# EAGLE design Controller2019_sensorless (EAGLE 9.1.1)
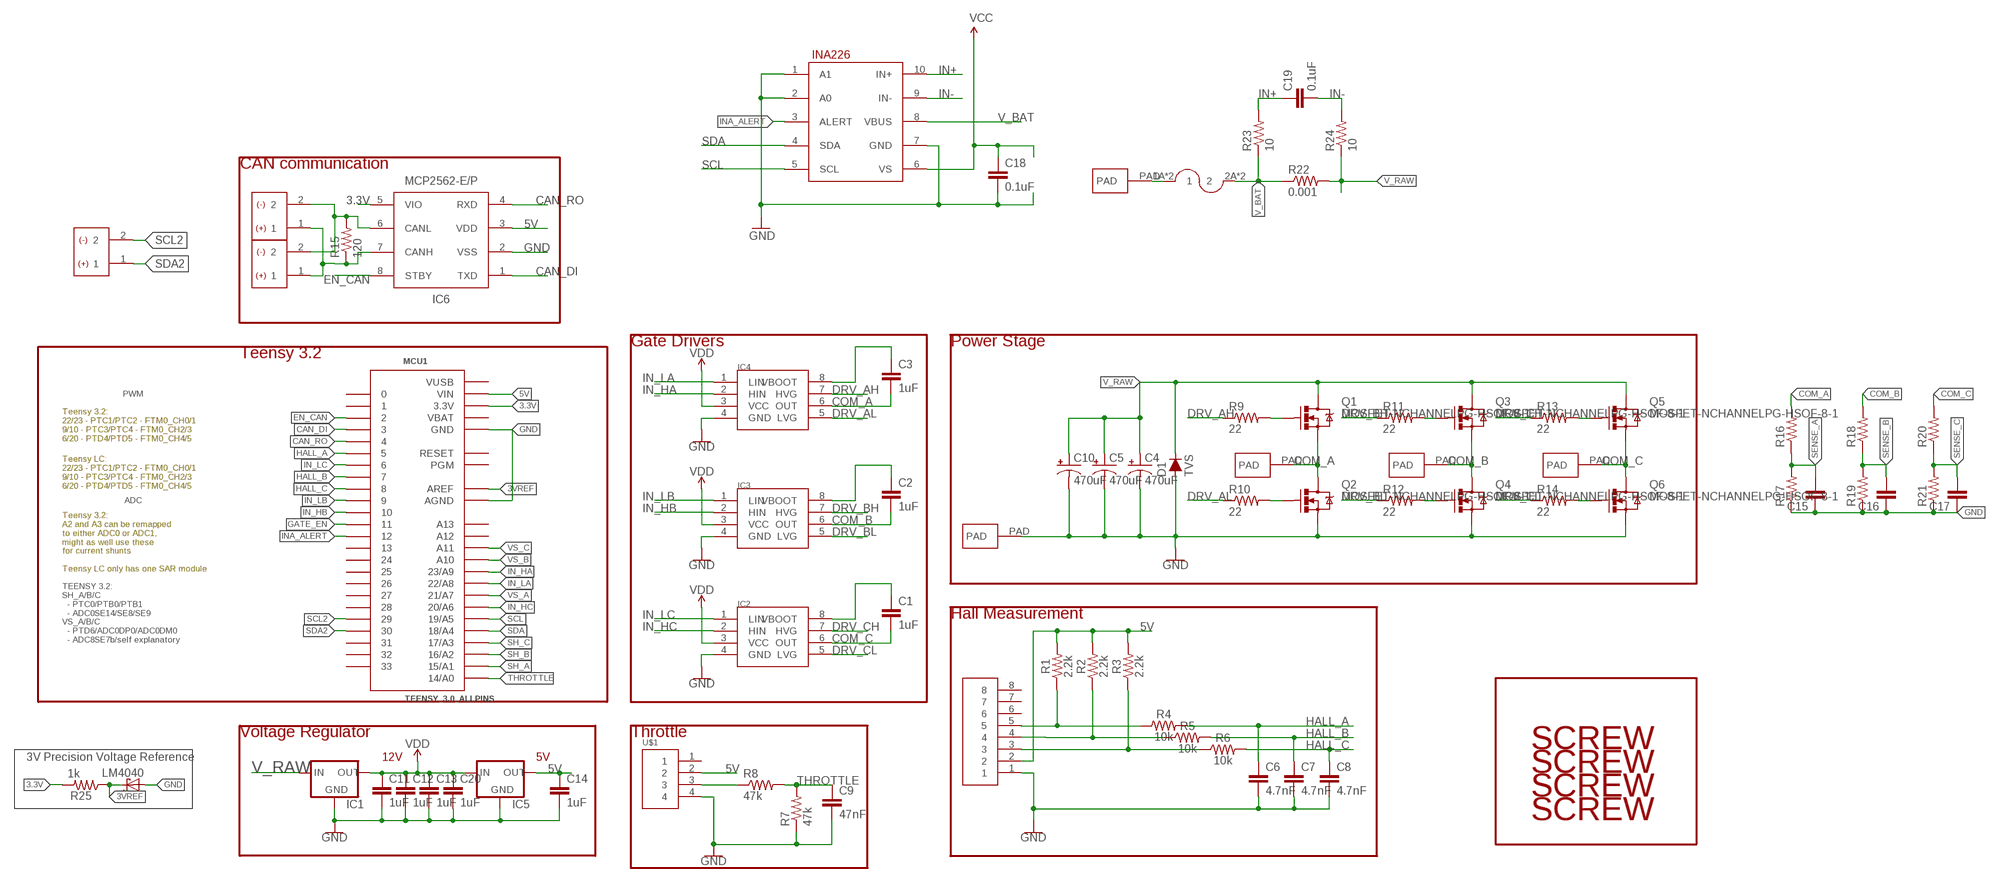
[diagram p0: schematic, sheet 1, part 1 of 2]
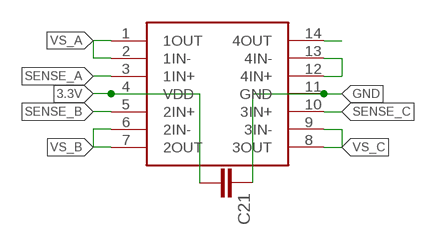
[diagram p1: schematic, sheet 1, part 2 of 2]

## Parts
C1  1uF  CAPKIT  [CAP-PTH-SMALL-KIT]
C2  1uF  CAPKIT  [CAP-PTH-SMALL-KIT]
C3  1uF  CAPKIT  [CAP-PTH-SMALL-KIT]
C4  470uF  1000UF-RADIAL-5MM-25V-20%  [CPOL-RADIAL-5MM-10MM]
C5  470uF  1000UF-RADIAL-5MM-25V-20%  [CPOL-RADIAL-5MM-10MM]
C6  4.7nF  CAP0603-CAP  [0603-CAP]
C7  4.7nF  CAP0603-CAP  [0603-CAP]
C8  4.7nF  CAP0603-CAP  [0603-CAP]
C9  47nF  CAP0603-CAP  [0603-CAP]
C10  470uF  1000UF-RADIAL-5MM-25V-20%  [CPOL-RADIAL-5MM-10MM]
C11  1uF  CAPKIT  [CAP-PTH-SMALL-KIT]
C12  1uF  CAPKIT  [CAP-PTH-SMALL-KIT]
C13  1uF  CAPKIT  [CAP-PTH-SMALL-KIT]
C14  1uF  CAPKIT  [CAP-PTH-SMALL-KIT]
C15  CAP0603-CAP  [0603-CAP]
C16  CAP0603-CAP  [0603-CAP]
C17  CAP0603-CAP  [0603-CAP]
C18  0.1uF  CAP0603-CAP  [0603-CAP]
C19  0.1uF  CAP0603-CAP  [0603-CAP]
C20  1uF  CAPKIT  [CAP-PTH-SMALL-KIT]
C21  CAP0603-CAP  [0603-CAP]
CAN1  HEADER2  [2PINVALULOK]
CAN2  HEADER2  [2PINVALULOK]
D1  TVS  DIODE-PTH  [DIODE-1N4001]
I2C  HEADER2  [2PINVALULOK]
IC1  V_REG_78XX  [V78W_BACKWARDS]
IC2  L6387EDIP8  [DIP762W53P254L1092H508Q8B]
IC3  L6387EDIP8  [DIP762W53P254L1092H508Q8B]
IC4  L6387EDIP8  [DIP762W53P254L1092H508Q8B]
IC5  V_REG_78XXV78W  [V78W]
IC6  MCP2562-E/P  [PDIP8_300MC]
IC7  INA226  [PSOP-10]
J3  FUSE  [AUTO_FUSE]
MCU1  TEENSY_3.0_ALLPINS  [TEENSY_3.0_ALLPINS]
Q1  MOSFET-NCHANNELPG-HSOF-8-1  [PG-HSOF-8-1]
Q2  MOSFET-NCHANNELPG-HSOF-8-1  [PG-HSOF-8-1]
Q3  MOSFET-NCHANNELPG-HSOF-8-1  [PG-HSOF-8-1]
Q4  MOSFET-NCHANNELPG-HSOF-8-1  [PG-HSOF-8-1]
Q5  MOSFET-NCHANNELPG-HSOF-8-1  [PG-HSOF-8-1]
Q6  MOSFET-NCHANNELPG-HSOF-8-1  [PG-HSOF-8-1]
R1  2.2k  RESISTOR0603  [0603]
R2  2.2k  RESISTOR0603  [0603]
R3  2.2k  RESISTOR0603  [0603]
R4  10k  RESISTOR0603  [0603]
R5  10k  RESISTOR0603  [0603]
R6  10k  RESISTOR0603  [0603]
R7  47k  RESISTOR0603-RES  [0603-RES]
R8  47k  RESISTOR0603-RES  [0603-RES]
R9  22  RESISTOR0603-RES  [0603-RES]
R10  22  RESISTOR0603-RES  [0603-RES]
R11  22  RESISTOR0603-RES  [0603-RES]
R12  22  RESISTOR0603-RES  [0603-RES]
R13  22  RESISTOR0603-RES  [0603-RES]
R14  22  RESISTOR0603-RES  [0603-RES]
R15  120  RESISTOR0603-RES  [0603-RES]
R16  RESISTOR0603-RES  [0603-RES]
R17  RESISTOR0603-RES  [0603-RES]
R18  RESISTOR0603-RES  [0603-RES]
R19  RESISTOR0603-RES  [0603-RES]
R20  RESISTOR0603-RES  [0603-RES]
R21  RESISTOR0603-RES  [0603-RES]
R22  0.001  RESISTOR2512  [R2512]
R23  10  RESISTOR0603-RES  [0603-RES]
R24  10  RESISTOR0603-RES  [0603-RES]
R25  1k  RESISTOR0603-RES  [0603-RES]
U$1  HEADER4VALULOK  [4PINVALULOK]
U$2  OPAMP_QUAD  [TSSOP-14]
U$4  PAD  [PAD]
U$5  PAD  [PAD]
U$6  PAD  [PAD]
U$7  PAD  [PAD]
U$8  PAD  [PAD]
U$10  SCREW  [M3HOLE]
U$11  SCREW  [M3HOLE]
U$12  SCREW  [M3HOLE]
U$13  SCREW  [M3HOLE]
U$14  HEADER8  [8PINVALULOK]
U$15  LM4040  [SOT23-3]

## Nets
3.3V: C21.2 IC6.5(VIO) MCU1.3.3V MCU1.3.3V1(3.3V) MCU1.3.3V2(3.3V) R25.2 U$2.4(VDD)
3VREF: MCU1.AREF R25.1 U$15.1(C)
5V: C14.1 IC5.OUT IC6.3(VDD) MCU1.VIN R1.2 R2.2 R3.2 U$1.2 U$14.2
CAN_DI: IC6.1(TXD) MCU1.3
CAN_RO: IC6.4(RXD) MCU1.4
CANH: CAN1.1 CAN2.1 IC6.7(CANH) R15.1
CANL: CAN1.2 CAN2.2 IC6.6(CANL) R15.2
COM_A: C3.2 IC4.6(OUT) Q1.S Q2.D R16.2 U$6.PAD
COM_B: C2.2 IC3.6(OUT) Q3.S Q4.D R18.2 U$7.PAD
COM_C: C1.2 IC2.6(OUT) Q5.S Q6.D R20.2 U$8.PAD
DRV_AH: IC4.7(HVG) R9.1
DRV_AL: IC4.5(LVG) R10.1
DRV_BH: IC3.7(HVG) R11.1
DRV_BL: IC3.5(LVG) R12.1
DRV_CH: IC2.7(HVG) R13.1
DRV_CL: IC2.5(LVG) R14.1
EN_CAN: IC6.8(STBY) MCU1.2
GATE_EN: MCU1.11
GND: C4.- C5.- C6.2 C7.2 C8.2 C9.2 C10.- C11.2 C12.2 C13.2 C14.2 C15.1 C16.1 C17.1 C18.2 C20.2 C21.1 D1.A IC1.GND IC2.4(GND) IC3.4(GND) IC4.4(GND) IC5.GND IC6.2(VSS) IC7.1(A1) IC7.2(A0) IC7.7(GND) MCU1.AGND MCU1.GND MCU1.GND1(GND) MCU1.GND2(GND) Q2.S Q4.S Q6.S R7.1 R17.1 R19.1 R21.1 U$1.4 U$2.11(GND) U$5.PAD U$14.1 U$15.2(A)
HALL_A: C6.1 MCU1.5 R4.2
HALL_B: C7.1 MCU1.7 R5.2
HALL_C: C8.1 MCU1.8 R6.2
IN+: C19.1 IC7.10(IN+) R23.2
IN-: C19.2 IC7.9(IN-) R24.2
IN_HA: IC4.2(HIN) MCU1.23/A9
IN_HB: IC3.2(HIN) MCU1.10
IN_HC: IC2.2(HIN) MCU1.20/A6
IN_LA: IC4.1(LIN) MCU1.22/A8
IN_LB: IC3.1(LIN) MCU1.9
IN_LC: IC2.1(LIN) MCU1.6
INA_ALERT: IC7.3(ALERT) MCU1.12
N$1: C1.1 IC2.8(VBOOT)
N$2: R3.1 R6.1 U$14.3
N$3: C2.1 IC3.8(VBOOT)
N$4: R2.1 R5.1 U$14.4
N$5: C3.1 IC4.8(VBOOT)
N$6: R1.1 R4.1 U$14.5
N$7: R8.1 U$1.3
N$9: Q1.G R9.2
N$10: Q2.G R10.2
N$11: Q3.G R11.2
N$12: Q4.G R12.2
N$13: Q5.G R13.2
N$14: Q6.G R14.2
N$26: U$2.12(4IN+) U$2.13(4IN-)
N$27: U$2.14(4OUT)
SCL: IC7.5(SCL) MCU1.19/A5
SCL2: I2C.2 MCU1.29
SDA: IC7.4(SDA) MCU1.18/A4
SDA2: I2C.1 MCU1.30
SENSE_A: C15.2 R16.1 R17.2 U$2.3(1IN+)
SENSE_B: C16.2 R18.1 R19.2 U$2.5(2IN+)
SENSE_C: C17.2 R20.1 R21.2 U$2.10(3IN+)
SH_A: MCU1.15/A1
SH_B: MCU1.16/A2
SH_C: MCU1.17/A3
THROTTLE: C9.1 MCU1.14/A0 R7.2 R8.2
V_BAT: IC7.8(VBUS) J3.2A J3.2B R22.1 R23.1
V_PREFUSE: J3.1A J3.1B U$4.PAD
V_RAW: C4.+ C5.+ C10.+ D1.C IC1.IN Q1.D Q3.D Q5.D R22.2 R24.1
VCC: C18.1 IC7.6(VS)
VDD: C11.1 C12.1 C13.1 C20.1 IC1.OUT IC2.3(VCC) IC3.3(VCC) IC4.3(VCC) IC5.IN
VS_A: MCU1.21/A7 U$2.1(1OUT) U$2.2(1IN-)
VS_B: MCU1.A10 U$2.6(2IN-) U$2.7(2OUT)
VS_C: MCU1.A11 U$2.8(3OUT) U$2.9(3IN-)
Unconnected: MCU1.0 MCU1.1 MCU1.13 MCU1.24 MCU1.25 MCU1.26 MCU1.27 MCU1.28 MCU1.31 MCU1.32 MCU1.33 MCU1.A12 MCU1.A13 MCU1.PGM MCU1.RESET U$1.1 U$14.6 U$14.7 U$14.8

## Notes on the sheet
- CAN communication
- Gate Drivers | Power Stage
- Teensy 3.2
- PWM
- Teensy 3.2:
  22/23 - PTC1/PTC2 - FTM0_CH0/1
  9/10 - PTC3/PTC4 - FTM0_CH2/3
  6/20 - PTD4/PTD5 - FTM0_CH4/5
- Teensy LC:
  22/23 - PTC1/PTC2 - FTM0_CH0/1
  9/10 - PTC3/PTC4 - FTM0_CH2/3
  6/20 - PTD4/PTD5 - FTM0_CH4/5
- ADC
- Teensy 3.2:
  A2 and A3 can be remapped
  to either ADC0 or ADC1,
  might as well use these
  for current shunts
  
  Teensy LC only has one SAR module
- Hall Measurement
- TEENSY 3.2:
  SH_A/B/C
    - PTC0/PTB0/PTB1
    - ADC0SE14/SE8/SE9
  VS_A/B/C
    - PTD6/ADC0DP0/ADC0DM0
    - ADC8SE7b/self explanatory
- Voltage Regulator | Throttle
- 3V Precision Voltage Reference | 12V | 5V

## Power pins joined to a net without a drawn wire
VBAT: MCU1.VBAT
VUSB: MCU1.VUSB

## Library data of the parts
C1-C3 C11-C14 C20 = SparkFun-Capacitors:CAP: Capacitor Standard 0603 ceramic capacitor, and 0.1" leaded capacitor.
C4 C5 C10 = SparkFun-Capacitors:1000UF: 1,000µF/1mF ceramic capacitors A capacitor is a passive two-terminal electrical component used to store electrical energy temporarily in an electric field. CAP-08070; PROD_ID: CAP-09538; VALUE: 1mF
C6-C9 C15-C19 C21 = SparkFun-Passives:CAP: Capacitor Standard 0603 ceramic capacitor, and 0.1" leaded capacitor.
CAN1 CAN2 I2C = Custom_old:HEADER2
D1 = SparkFun-DiscreteSemi:DIODE: Diode These are standard reverse protection diodes and small signal diodes. SparkFun Products: SparkFun SparkPunk Sound Kit <https://www.sparkfun.com/products/11177> SparkFun ESP8266 Thing <https://www.sparkfun.com/products/13231>; PROD_ID: DIO-09176; VALUE: 1A/50V/1.1V
IC1 IC5 = 2018:V_REG_78XX: Voltage Regulator Standard 7805 5V regulator. IGO (Input Ground Output). Spark Fun Electronics SKU : COM-00107
IC2-IC4 = Custom_old:L6387E
IC6 = Custom_new:MCP2562-E/P; MANUFACTURER_PART_NUMBER: MCP2562EP; VENDOR: Microchip
IC7 = Custom_old:INA226
J3 = Custom_old:FUSE
MCU1 = Teensy3.0:TEENSY_3.0_ALLPINS: Teensy 3.0 with all pin holes and optional SMD-mount unshrouded header on bottom of Teensy 3.0. For more basic versions, see 'Basic', '+4' and 'AllAnalogPins'. Requires the installation of a un-shrouded SMD header on the underside of the Teensy 3.0
Q1-Q6 = Custom_old:MOSFET-NCHANNEL: Generic NMOS footprint
R1-R6 = SparkFun-Resistors:RESISTOR: Generic Resistor Package
R7-R21 R23-R25 = SparkFun-Passives:RESISTOR: Resistor Basic schematic elements and footprints for 0603, 1206, and PTH resistors.
R22 = SparkFun-Resistors:RESISTOR: Resistor Basic schematic elements and footprints for 0603, 1206, and PTH resistors.
U$1 = Custom_old:HEADER4
U$2 = 2018:OPAMP_QUAD
U$4-U$8 = Custom_old:PAD
U$10-U$13 = Custom_old:SCREW
U$14 = Custom_old:HEADER8
U$15 = 2018:LM4040

## Board
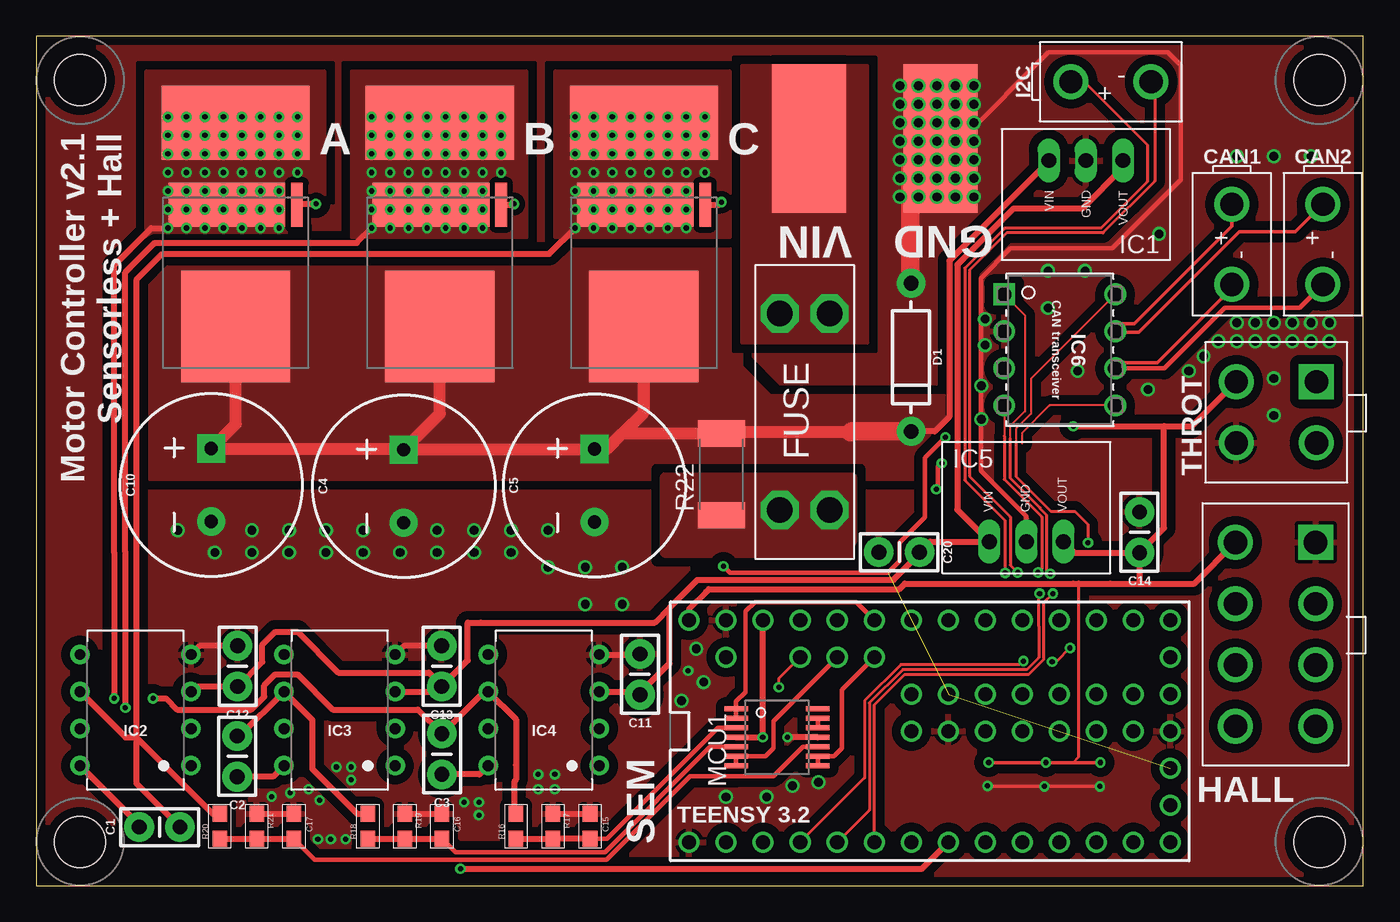
[diagram p2: board, top side]
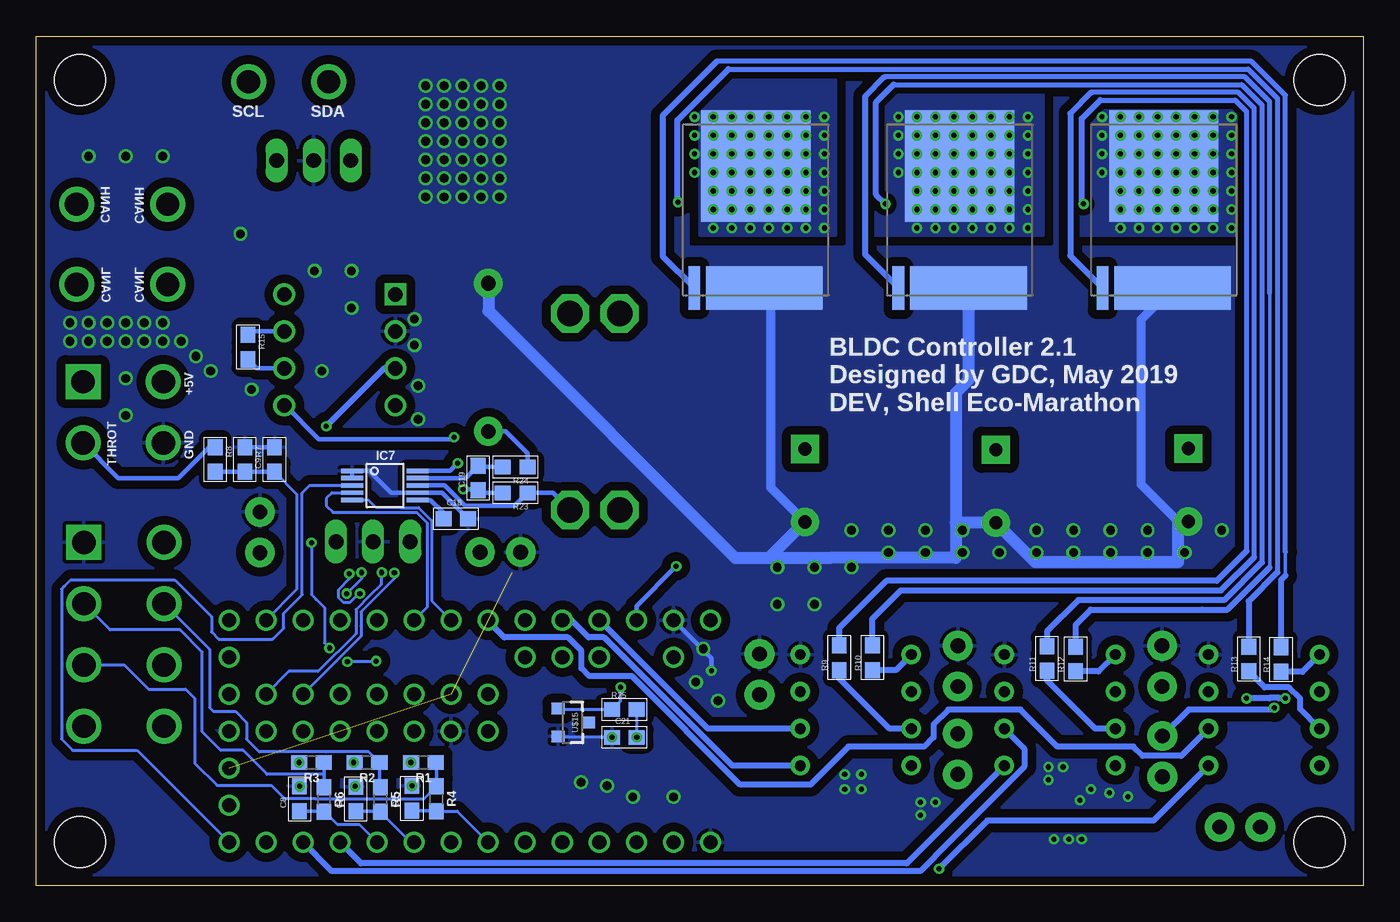
[diagram p3: board, bottom side, seen from below]

Size 91 x 58.22 mm. Coordinates in mm from the lower left corner, seen from the top.
Outline: 0,0 91,0 91,58.22 0,58.22 0,0
Copper layers (1*16): Top 0.0356mm / dielectric 1.5011mm / Bottom 0.0356mm
Design rules "jlcpcb_tented *": minimum track width 5mil, minimum drill 13mil, track to track 5mil, track to pad 5mil, pad to pad 5mil, via to via 5mil, smd to smd 5mil, copper to edge 15mil, drill to drill 6mil, minimum pad ring 7mil, minimum via ring 7mil, stop-mask expansion 2.5mil, vias tented up to drill 0.6mm, thermal gap 10mil

### Footprints (pad centres in the part's own frame; a part is rotated, then mirrored left to right if it is on the bottom)
CAP-PTH-SMALL-KIT = drill 1.016 pad 2.032: 1 -1.397,0; 2 1.397,0
CPOL-RADIAL-5MM-10MM = drill 0.9 pad 1.93 square: + 2.5,0 | drill 0.9 pad 1.93: - -2.5,0
0603-CAP = smd 1.1 x 1: 1 -0.85,0; 2 0.85,0
2PINVALULOK = drill 1.6: 1 0,5.5; 2 0,0
DIODE-1N4001 = drill 1 pad 1.981: A -5.08,0; C 5.08,0
V78W_BACKWARDS = drill 1.016 long: GND 0,-3.81; IN 2.54,-3.81; OUT -2.54,-3.81
DIP762W53P254L1092H508Q8B = drill 0.743 pad 1.343: 1 -3.81,3.81; 2 -3.81,1.27; 3 -3.81,-1.27; 4 -3.81,-3.81; 5 3.81,-3.81; 6 3.81,-1.27; 7 3.81,1.27; 8 3.81,3.81
V78W = drill 1.016 long: GND 0,-3.81; IN -2.54,-3.81; OUT 2.54,-3.81
PDIP8_300MC = drill 0.991 pad 1.499 square: 1 -7.62,7.62 | drill 0.991 pad 1.499: 2 -7.62,5.08; 3 -7.62,2.54; 4 -7.62,0; 5 0,0; 6 0,2.54; 7 0,5.08; 8 0,7.62
PSOP-10 = smd 1.5 x 0.3: 1 0,1; 2 0,0.5; 3 0,0; 4 0,-0.5; 5 0,-1; 6 4.5,-1; 7 4.5,-0.5; 8 4.5,0; 9 4.5,0.5; 10 4.5,1
AUTO_FUSE = drill 1.75 octagon: 1A 0,3.4; 1B 0,0; 2A 13.47,3.4; 2B 13.47,0
TEENSY_3.0_ALLPINS = drill 0.965: 0 -7.62,13.97; 1 -7.62,11.43; 2 -7.62,8.89; 3 -7.62,6.35; 3.3V 7.62,11.43; 3.3V1 -2.54,-16.51; 3.3V2 2.54,-1.27; 4 -7.62,3.81; 5 -7.62,1.27; 6 -7.62,-1.27; 7 -7.62,-3.81; 8 -7.62,-6.35; 9 -7.62,-8.89; 10 -7.62,-11.43; 11 -7.62,-13.97; 12 -7.62,-16.51; 13 7.62,-16.51; 14/A0 7.62,-13.97; 15/A1 7.62,-11.43; 16/A2 7.62,-8.89; 17/A3 7.62,-6.35; 18/A4 7.62,-3.81; 19/A5 7.62,-1.27; 20/A6 7.62,1.27; 21/A7 7.62,3.81; 22/A8 7.62,6.35; 23/A9 7.62,8.89; 24 0,-3.81; 25 0,-6.35; 26 0,-8.89; 27 0,-11.43; 28 0,-13.97; 29 2.54,-13.97; 30 2.54,-11.43; 31 2.54,-8.89; 32 2.54,-6.35; 33 2.54,-3.81; A10 5.08,6.35; A11 5.08,3.81; A12 0,1.27; A13 2.54,1.27; AGND 7.62,13.97; AREF 5.08,8.89; GND -7.62,16.51; GND1 0,-16.51; GND2 0,-1.27; PGM 2.54,-16.51; RESET 5.08,-16.51; VBAT -5.08,-16.51; VIN 7.62,16.51; VUSB 5.08,13.97
PG-HSOF-8-1 = smd 7.5 x 7.65: D 0,8.855 | smd 0.8 x 3: G -4.2,0.5 | smd 8 x 3: S 0.6,0.5
0603 = smd 1.1 x 1: 1 -0.85,0; 2 0.85,0
0603-RES = smd 1.1 x 1: 1 -0.85,0; 2 0.85,0
R2512 = smd 1.8 x 3.2: 1 -2.8,0; 2 2.8,0
4PINVALULOK = drill 1.6 square: 1 0,5.5 | drill 1.6: 2 0,0; 3 4.2,5.5; 4 4.2,0
TSSOP-14 = smd 1.6 x 0.35: 1 -2.8,1.95; 2 -2.8,1.3; 3 -2.8,0.65; 4 -2.8,0; 5 -2.8,-0.65; 6 -2.8,-1.3; 7 -2.8,-1.95; 8 2.8,-1.95; 9 2.8,-1.3; 10 2.8,-0.65; 11 2.8,0; 12 2.8,0.65; 13 2.8,1.3; 14 2.8,1.95
PAD = smd 10.16 x 5.08: PAD 0,0
M3HOLE = hole 3.5: 0,0
8PINVALULOK = drill 1.6 square: 1 0,5.5 | drill 1.6: 2 0,0; 3 4.2,5.5; 4 4.2,0; 5 8.4,5.5; 6 8.4,0; 7 12.6,5.5; 8 12.6,0
SOT23-3 = smd 0.8 x 0.9: 1 -0.95,-1; 2 0.95,-1; 3 0,1.1

### Placement (x,y rotation side)
C1  8.45,4.01 0 top
C2  13.77,8.86 90 top
C3  27.81,9.02 90 top
C4  25.2,27.38 90 top
C5  38.28,27.43 90 top
C6  65.24,5.98 90 bottom
C7  69.1,5.93 90 bottom
C8  72.95,5.94 90 bottom
C9  74.68,29.21 90 bottom
C10  11.99,27.46 90 top
C11  41.4,14.48 90 top
C12  13.8,15.04 90 top
C13  27.8,15.04 90 top
C14  75.67,24.22 90 top
C15  37.97,4.06 270 top
C16  27.81,4.06 270 top
C17  17.65,4.06 270 top
C18  62.23,25.15 0 bottom
C19  60.71,27.94 90 bottom
C20  59.18,22.86 180 top
C21  50.67,10.16 0 bottom
CAN1  82,41.22 0 top
CAN2  88.25,41.22 0 top
D1  60,36.22 270 top
I2C  76.45,55.12 90 top
IC1  71.98,45.9 180 top
IC2  6.8,12.02 180 top
IC3  20.8,12.02 180 top
IC4  34.8,12.02 180 top
IC5  67.91,27.39 0 top
IC6  74,32.92 0 top
IC7  69.34,27.43 0 bottom
J3  51,39.22 270 top
MCU1  61.28,10.58 90 top
Q1  13.67,47.17 180 top
Q2  13.67,40.48 0 bottom
Q3  27.67,47.17 180 top
Q4  27.67,40.48 0 bottom
Q5  41.67,47.17 180 top
Q6  41.67,40.48 0 bottom
R1  64.47,8.43 180 bottom
R2  68.33,8.43 180 bottom
R3  72.14,8.43 180 bottom
R4  63.57,5.94 270 bottom
R5  67.41,5.89 270 bottom
R6  71.27,5.89 270 bottom
R7  76.71,29.21 270 bottom
R8  78.74,29.21 270 bottom
R9  35.94,15.62 90 bottom
R10  33.66,15.62 90 bottom
R11  21.68,15.56 90 bottom
R12  19.72,15.53 90 bottom
R13  7.84,15.53 90 bottom
R14  5.62,15.5 90 bottom
R15  76.49,36.92 270 bottom
R16  32.89,4.06 90 top
R17  35.43,4.06 270 top
R18  22.73,4.06 90 top
R19  25.27,4.06 270 top
R20  12.57,4.06 90 top
R21  15.11,4.06 270 top
R22  46.99,28.19 90 top
R23  58.17,26.92 180 bottom
R24  58.17,28.7 180 bottom
R25  50.67,12.06 0 bottom
U$1  82.3,34.54 270 top
U$2  50.8,10.16 0 top
U$3  [DEV]  55.17,30.33 0 bottom
U$4  53,51.22 90 top
U$5  62,51.22 270 top
U$6  13.67,52.31 0 top
U$7  27.67,52.31 0 top
U$8  41.67,52.31 0 top
U$10  88,55.22 0 top
U$11  88,3 0 top
U$12  3,3 0 top
U$13  3,55.22 0 top
U$14  82.25,23.52 270 top
U$15  54.23,11.18 270 bottom

### Tracks (layer width: path | path; a pad name or v marks a point on that pad's centre or on a via)
3.3V  (via drill 0.35)  (2 unrouted)
  Top 0.152: IC6.5 69.49,32.92 67.6,31.02 67.6,30.31
  Top 0.305: 49.82,18.17 MCU1.3.3V | v47.12,21.89 47.57,21.44 58.4,21.44 59.18,22.23 59.18,23.49 60.96,25.27 60.96,29.34 v62.36,30.73
  Top 0.406: U$2.4 C21.2 49.82,17.78 | 49.82,17.78 49.82,18.17 | 49.82,17.78
  Bottom 0.203: R25.2 C21.2
  Bottom 0.305: MCU1.3.3V 49.85,19.16 v47.12,21.89 | v62.36,30.73 62.48,30.61 71.64,30.61 73.94,32.92 IC6.5
  other vias: 49.82,10.16
3VREF  (via drill 0.35)
  Top 0.203: v50.93,13.59 50.93,14.2 MCU1.AREF
  Bottom 0.203: U$15.1 55.17,12.06 R25.1 50.93,12.66 v50.93,13.59
5V  (via drill 0.35)
  Top 0.203: 71.12,8.43 71.5,8.81 71.5,20.7
  Top 0.254: R3.2 71.12,8.43 v69.24,8.43 R1.2
  Top 0.406: 46.13,20.32 45.92,20.12 | 45.92,20.12 44.77,18.96 MCU1.VIN | v71.12,31.5 73.41,31.5 77.34,31.5 | 77.34,31.5 79.25,31.5 U$1.2 | 77.34,31.5 77.34,24.5 C14.1 | C14.1 75.67,20.7 | IC5.OUT 71.21,22.82 C14.1 | 45.92,20.12 46.13,20.32 | 46.13,20.32 59.18,20.32 59.56,20.7 71.12,20.7 71.5,20.7 73.66,20.7 75.67,20.7 | 75.67,20.7 79.43,20.7 U$14.2
  Bottom 0.152: R2.2 v69.24,8.43
  Bottom 0.406: IC6.3 67.16,35.46 v71.12,31.5
  other vias: 72.99,8.43 65.32,8.43
CAN_DI  (via drill 0.35)
  Top 0.152: IC6.1 67.82,39.1 67.82,32.51 66.79,31.48 66.79,30.65
  Top 0.203: MCU1.3 57.14,5.17 57.14,12.52 59.43,14.81 67.94,14.81 68.76,15.63 68.76,17.78 68.76,19.96 v68.81,20.02 | 66.79,30.65 66.79,27.96 68.83,25.91 68.83,25.87 69.29,25.41 69.29,21.56 69.47,21.38 v69.54,21.38
  Bottom 0.203: v68.81,20.02 68.9,20.02 69.48,19.44 69.96,19.44 70.3,19.78 70.3,20.26 69.54,21.02 v69.54,21.38
CAN_RO  (via drill 0.35)
  Top 0.152: IC6.4 66.38,30.82
  Top 0.203: MCU1.4 57.47,12.38 58.1,13.02 59.56,14.48 68.07,14.48 69.09,15.49 69.09,19.38 v69.72,20.02 | 66.38,30.82 66.38,27.85 68.96,25.27 68.96,21.72 v68.71,21.46
  Bottom 0.203: v69.72,20.02 69,20.74 68.71,21.03 v68.71,21.46
CANH
  Top 0.254: CAN2.1 86.35,44.82 82.51,44.82 75.61,37.93 74.07,37.93 IC6.7 74.51,38.51 75.31,38.51 82,45.2 CAN1.1
  Bottom 0.305: R15.1 76.26,38 IC6.7
CANL
  Top 0.254: CAN1.2 82,40.97 76.88,35.85 74.39,35.85 IC6.6
  Top 0.305: CAN2.2 86.66,39.62 81.53,39.62 77.37,35.46 IC6.6
  Bottom 0.305: R15.2 75.88,35.46 IC6.6
COM_A  (via drill 0.35)
  Top 0.406: v9.02,45.09 7.87,45.09 5.33,42.55 5.33,22.86 | R16.2 32.77,4.79 32.77,7.11 32.89,7.24 32.89,8.25 32.89,11.39 IC4.6 30.69,13.29 C3.2 26.16,12.06 20.32,12.06 17.91,14.48 16.38,14.48 15.62,13.72 15.62,12.95 14.73,12.06 9.65,12.06 8.89,12.83 v8,12.83 | 5.33,22.86 | 5.33,22.86 v5.33,12.83
  Bottom 0.406: v5.33,12.83 5.76,12.83 5.81,12.88 6.38,12.88 6.43,12.83 v8,12.83
  other vias: 10.29,51.44 12.83,51.44 15.37,51.44 17.91,51.44 17.91,48.89 15.37,48.89 12.83,48.89 10.29,48.89 10.29,46.36 12.83,46.36 15.37,46.36 16.64,51.44 14.1,51.44 11.56,51.44 11.56,48.89 14.1,48.89 16.64,48.89 11.56,46.36 14.1,46.36 16.64,46.36 14.1,47.62 11.56,47.62 14.1,50.16 11.56,50.16 11.56,52.7 14.1,52.7 16.64,52.7 16.64,50.16 16.64,47.62 15.37,47.62 12.83,50.16 12.83,47.62 10.29,47.62 10.29,50.16 10.29,52.7 12.83,52.7 15.37,52.7 17.91,52.7 15.37,50.16 17.91,50.16 9.02,52.7 9.02,51.44 9.02,50.16 9.02,48.89 9.02,47.62 9.02,46.36 10.29,45.09 11.56,45.09 12.83,45.09 14.1,45.09 15.37,45.09 16.64,45.09
  pour Bottom (isolate 0.406, rank 4, no thermals): 8.26,55.25 8.26,44.58 20.45,44.58 20.45,55.25
  pour Top (isolate 0.406, no thermals): 7.52,55.82 7.52,44.46 19.78,44.46 19.78,55.82
COM_B  (via drill 0.35)
  Top 0.406: C2.2 13.95,10.25 IC3.6 18.92,11.36 18.92,8 22.01,4.91 R18.2 | v22.99,45.09 21.97,44.07 8.13,44.07 6.1,42.04 6.1,22.86 v6.1,12.19
  Bottom 0.406: C2.2 11.96,12.06 6.22,12.06 v6.1,12.19
  other vias: 24.26,51.44 24.26,48.89 24.26,52.7 24.26,50.16 25.53,51.44 28.07,51.44 28.07,48.89 25.53,48.89 26.8,51.44 26.8,48.89 26.8,52.7 26.8,50.16 25.53,52.7 28.07,52.7 25.53,50.16 28.07,50.16 29.34,51.44 31.88,51.44 31.88,48.89 29.34,48.89 30.61,51.44 30.61,48.89 30.61,52.7 30.61,50.16 29.34,52.7 31.88,52.7 29.34,50.16 31.88,50.16 22.99,52.7 22.99,51.44 22.99,50.16 22.99,48.89 22.99,46.36 24.26,46.36 25.53,46.36 26.8,46.36 28.07,46.36 29.34,46.36 30.61,46.36 24.26,47.62 28.07,47.62 25.53,47.62 26.8,47.62 29.34,47.62 30.61,47.62 22.99,47.62 24.26,45.09 28.07,45.09 25.53,45.09 26.8,45.09 29.34,45.09 30.61,45.09
  pour Bottom (isolate 0.406, rank 4, no thermals): 21.97,55.25 21.97,44.58 33.91,44.58 33.91,55.25
  pour Top (isolate 0.406, no thermals): 21.62,55.82 21.62,44.46 33.62,44.46 33.62,55.82
COM_C  (via drill 0.35)
  Top 0.406: v36.96,45.09 35.18,43.31 8.64,43.31 6.86,41.53 6.86,10.16 | C1.2 6.86,6.99 6.86,10.16 | 6.86,10.16 12.1,4.91 R20.2 | 6.86,10.16 6.12,10.16 IC2.6
  other vias: 38.23,51.44 38.23,48.89 38.23,52.7 38.23,50.16 39.5,51.44 42.04,51.44 42.04,48.89 39.5,48.89 40.77,51.44 40.77,48.89 40.77,52.7 40.77,50.16 39.5,52.7 42.04,52.7 39.5,50.16 42.04,50.16 43.31,51.44 45.85,51.44 45.85,48.89 43.31,48.89 44.58,51.44 44.58,48.89 44.58,52.7 44.58,50.16 43.31,52.7 45.85,52.7 43.31,50.16 45.85,50.16 36.96,52.7 36.96,51.44 36.96,50.16 36.96,48.89 38.23,47.62 38.23,45.09 38.23,46.36 39.5,47.62 42.04,47.62 42.04,45.09 39.5,45.09 40.77,47.62 40.77,45.09 40.77,46.36 39.5,46.36 42.04,46.36 43.31,47.62 43.31,45.09 44.58,47.62 44.58,45.09 44.58,46.36 43.31,46.36 36.96,47.62 36.96,46.36
  pour Top (isolate 0.406, rank 3, no thermals): 35.54,52.78 46,52.52 arc90 45.75,52.78
  pour Bottom (isolate 0.406, rank 4, no thermals): 36.2,55.25 36.2,44.58 45.47,44.58 45.47,55.25
  pour Top (isolate 0.406, no thermals): 35.59,55.82 35.59,44.46 47.59,44.46 47.59,55.82
DRV_AH
  Bottom 0.406: IC4.7 32.47,10.75 35.94,14.22 R9.1
DRV_AL
  Bottom 0.406: IC4.5 32.05,14.77 R10.1
DRV_BH
  Bottom 0.406: IC3.7 18.38,10.75 21.68,14.06 R11.1
DRV_BL
  Bottom 0.406: IC3.5 18.14,14.68 R12.1
DRV_CH
  Bottom 0.406: IC2.7 4.32,12.09 4.32,12.83 5.08,13.59 6.75,13.59 R13.1
DRV_CL
  Bottom 0.406: IC2.5 4.17,14.66 R14.1
EN_CAN  (via drill 0.35)
  Top 0.152: IC6.8 68.22,34.76 68.22,32.34 67.19,31.31 67.19,30.48
  Top 0.203: 67.19,30.48 67.19,28.06 69.6,25.65 71.25,25.65 72.14,24.77 v72.14,23.51 | v70.9,16.29 69.95,15.34 v69.67,15.34 | v67.69,15.39 67.44,15.14 59.29,15.14 56.81,12.66 56.81,7.38 MCU1.2
  Bottom 0.203: v72.14,23.51 72.14,19.94 71.82,19.62 71.25,19.05 71.25,16.64 v70.9,16.29 | v69.67,15.34 69.62,15.39 v67.69,15.39
GND  (via drill 0.35, 0.6)
  Top 0.152: 65.21,6.79 C6.2
  Top 0.254: C8.2 v69.14,6.79 65.21,6.79
  Top 0.305: IC5.GND 67.91,25.31 64.77,28.45 64.77,41.66 66.8,43.69 73.79,43.69 78.49,48.39 78.49,56.26 77.6,57.15 69.43,57.15 63.5,51.22 U$5.PAD
  Top 0.406: C12.2 11.21,16.44 IC2.4 | R21.1 C17.1 | R19.1 C16.1 | R17.1 C15.1 | C13.2 25.21,16.44 IC3.4 | IC4.4 41.36,15.84 C11.2 | U$2.11 C21.1
  Top 1.27: D1.A 59.97,41.33 59.97,49.19 U$5.PAD
  Bottom 0.152: C7.2 69.12,6.79 v69.14,6.79
  Bottom 0.203: C21.1 55.16,10.16 U$15.2
  Bottom 0.305: C18.2 63.17,26.93 IC7.7 66.68,26.93 68.18,28.43 IC7.1 IC7.2 | R7.1 C9.2 | MCU1.AGND 44.7,15.59 v44.7,14.73
  Bottom 0.61: Q2.S 15.24,38.8 15.24,27.5 12.7,24.96 | Q6.S 40.64,40.55 40.64,27.29 C5.-
  Bottom 0.813: C10.- 12.7,24.96 12.7,22.17 22.48,22.17 C4.- 27.94,24.88 | C5.- 40.73,22.47 | Q4.S 27.07,34.66 27.94,33.78 27.94,24.88 | 40.73,22.47 43.07,22.47 60,39.39 D1.A | 40.73,22.47 36.54,22.47 27.94,22.47 27.94,24.88
  other vias: 60.5,47.22 72.95,6.79 65.24,6.83 51.52,10.16 20.19,3.17 30.35,5.71 21.59,8.13 19.3,3.17 21.21,3.17 30.35,4.83 29.34,5.71 35.56,7.62 34.42,7.62 35.56,6.6 34.42,6.6 19.43,5.84 18.67,6.6 17.4,6.35 16.13,6.1 21.59,7.24 20.57,8.13 60.5,49.76 60.5,52.3 60.5,54.84 63.04,54.84 63.04,52.3 63.04,49.76 63.04,47.22 61.77,47.22 61.77,49.76 61.77,52.3 61.77,54.84 64.31,54.84 64.31,52.3 64.31,49.76 64.31,47.22 63.04,48.49 60.5,48.49 61.77,48.49 64.31,48.49 64.31,51.03 64.31,53.57 61.77,53.57 61.77,51.03 63.04,51.03 63.04,53.57 60.5,53.57 60.5,51.03 59.23,54.84 59.23,53.57 59.23,52.3 59.23,51.03 59.23,49.76 59.23,48.49 59.23,47.22 69.39,42.14 71.93,42.14 77.01,44.68 69.39,39.6 64.82,31.98 64.82,34.27 65.07,37.06 65.07,38.84 71.42,35.28 84.88,37.31 35.1,24.36 30.02,24.36 22.4,24.36 14.78,24.36 17.32,24.36 19.86,24.36 27.48,24.36 32.56,24.36 37.64,21.82 40.18,21.82 87.42,37.31 82.34,37.31 84.88,50.01 82.34,50.01 87.42,50.01 84.88,34.77 76.25,34.01 84.88,32.23 86.15,37.31 83.61,37.31 81.07,37.31 80.06,36.3 79.04,35.28 88.69,37.31 88.69,38.58 86.15,38.58 83.61,38.58 82.34,38.58 84.88,38.58 87.42,38.58 40.18,19.28 37.64,19.28 35.1,21.82 32.56,22.84 30.02,22.84 27.48,22.84 24.94,22.84 22.4,22.84 19.86,22.84 17.32,22.84 14.78,22.84 12.24,22.84 9.7,24.36 44.24,12.68 45.77,13.95 45.26,16.23 51.86,6.83 50.09,6.07 53.64,7.09 47.29,6.07
  pour Bottom (isolate 0.61, rank 5): -2,60.22 -2,-2 92,-2 92,60.22
  pour Top (isolate 0.61, rank 5): -1,59.22 -1,-0.75 arc90 -0.75,-1 91,-1 91,58.97 arc90 90.75,59.22
  pour Bottom (isolate 0.61, rank 5, no thermals): 7.62,43.18 48.26,43.18 48.26,22.86 7.62,22.86
  pour Bottom (isolate 0.61, rank 5, no thermals): 58.42,43.18 61.98,43.18 62.1,43.31 62.1,39.75 62.23,39.62 58.55,39.62 58.42,39.5
  pour Top (isolate 0.61, rank 5, no thermals): 58.42,58.42 66.04,58.42 66.04,44.32 61.21,39.5 58.42,39.5
  pour Top (isolate 0.61, rank 5, no thermals): 7.62,27.94 43.18,27.94 43.18,22.86 7.62,22.86
HALL_A
  Bottom 0.152: R4.2 63.6,5.13
  Bottom 0.203: R4.2 62.14,5.09 MCU1.5
  Bottom 0.254: 63.6,5.13 C6.1
HALL_B
  Bottom 0.152: R5.2 67.45,5.08
  Bottom 0.203: R5.2 65.33,2.96 MCU1.7
  Bottom 0.254: 67.45,5.08 C7.1
HALL_C
  Bottom 0.152: R6.2 71.32,5.09
  Bottom 0.203: R6.2 71.21,5.04 70.36,4.19 68.86,4.19 MCU1.8
  Bottom 0.254: 71.32,5.09 C8.1
IN+  (via drill 0.35)
  Top 0.305: v62.1,28.96 61.85,28.7 61.85,27.3 v61.72,27.18
  Bottom 0.305: R23.2 60.54,26.92 C19.1 60.79,27.18 v61.72,27.18 | IC7.10 62.63,28.43 v62.1,28.96
IN-
  Bottom 0.305: R24.2 60.62,28.7 C19.2 61.56,27.93 IC7.9
IN_HA
  Bottom 0.406: IC4.2 44.95,10.75 51.38,17.2 MCU1.23/A9
IN_HB
  Bottom 0.406: IC3.2 23.24,9.39 23.24,8.13 28.38,2.98 30.38,0.99 70.74,0.99 MCU1.10
IN_HC
  Bottom 0.406: MCU1.20/A6 60.01,18.11 58.92,17.02 54.54,17.02 53.62,16.1 53.62,14.89 53.09,14.35 50.16,14.35 42.73,6.92 37.91,6.92 35.31,9.52 30.1,9.52 29.46,10.16 29.46,11.05 28.45,12.06 23.5,12.06 20.95,9.52 15.75,9.52 15.11,8.89 12.47,8.89 IC2.2
IN_LA
  Bottom 0.406: IC4.1 43.27,8.21 52.07,17.02 53.11,17.02 54.3,18.2 MCU1.22/A8
IN_LB
  Bottom 0.406: IC3.1 31.3,1.52 68.73,1.52 MCU1.9
IN_LC  (via drill 0.35)
  Top 0.406: v29.08,1.14 60.73,1.14 MCU1.6
  Bottom 0.406: IC2.1 11.95,6.87 14.38,4.45 25.78,4.45 v29.08,1.14
INA_ALERT
  Bottom 0.203: 72.26,27.43 72.77,26.92 72.77,19.94 74.04,18.67 74.04,17.65 74.8,16.89 78.49,16.89 78.99,17.4 78.99,18.41 81.53,20.95 88.65,20.95 89.09,20.51 89.28,20.32 89.28,10.03 88.52,9.27 84.1,9.27 MCU1.12 | 72.26,27.43 | 72.26,27.43 IC7.3
N$1
  Top 0.406: IC2.8 7.05,4.15 C1.1
N$2
  Bottom 0.152: 71.27,8.42 R3.1
  Bottom 0.203: 71.27,7.62 75.18,7.62 76.83,9.27 78.36,9.27 79.63,10.54 79.63,16 81.15,17.53 85.95,17.53 U$14.3
  Bottom 0.254: R6.1 71.27,7.62 71.27,8.42
N$3
  Top 0.406: IC3.8 16.23,7.46 C2.1
N$4
  Bottom 0.152: 67.48,6.81 R5.1
  Bottom 0.203: R2.1 68.2,9.16 71.12,9.16 75.71,9.16 76.58,10.03 76.58,11.18 77.34,11.94 78.87,11.94 79.12,12.19 79.12,16.2 U$14.4
  Bottom 0.254: R2.1 67.48,7.62 67.48,6.81
N$5
  Top 0.406: IC4.8 30.39,7.62 C3.1
N$6
  Bottom 0.203: R4.1 64.39,5.96 71.87,5.96 71.87,5.97 74,5.97 74.89,6.86 78.61,6.86 80.14,8.38 80.14,12.83 80.77,13.46 83.31,13.46 84.97,15.12 U$14.5
  Bottom 0.254: R4.1 63.56,8.38 R1.1
N$7
  Bottom 0.305: R8.1 79.16,30.06 81.28,27.94 85.4,27.94 U$1.3
N$9  (via drill 0.35)
  Top 0.406: Q1.G 17.93,46.74 v19.18,46.74
  Bottom 0.356: 18.03,53.85 8.76,53.85 8,53.09 8,22.92
  Bottom 0.406: 18.03,53.85 19.3,52.58 19.3,46.86 v19.18,46.74 | 8,22.92 10.03,20.89 32.7,20.89 35.94,17.65 R9.2
N$10
  Bottom 0.356: 7.47,22.52 7.47,53.31 8.54,54.38 18.64,54.38
  Bottom 0.406: R10.2 33.66,18.29 32.32,19.62 | 32.32,19.62 31.71,20.23 9.75,20.23 7.47,22.52 | 32.32,19.62 | 18.64,54.38 20.09,52.93 20.09,43.2 Q2.G
N$11  (via drill 0.35)
  Top 0.406: Q3.G 32.7,46.67 v32.77,46.74
  Bottom 0.356: 32.21,54.91 8.32,54.91 6.93,53.53 6.93,27.94 6.93,22.16
  Bottom 0.406: v32.77,46.74 33.4,47.37 33.4,53.72 32.21,54.91 | 6.93,22.16 9.53,19.57 19.55,19.57 21.68,17.43 R11.2
N$12
  Bottom 0.254: 6.4,21.82 6.4,27.94 6.4,40.64
  Bottom 0.356: 6.4,40.64 6.4,53.75 8.1,55.45 32.82,55.45
  Bottom 0.406: R12.2 19.72,17.88 18.68,18.91 11.05,18.91 9.31,18.91 6.4,21.82 | 32.82,55.45 34.16,54.1 34.16,43.27 Q4.G
N$13  (via drill 0.35)
  Top 0.406: Q5.G 46.8,46.67 v46.99,46.86
  Bottom 0.356: 43.54,55.98 7.88,55.98 5.87,53.97 5.87,21.47
  Bottom 0.406: 43.54,55.98 47.04,52.48 47.04,46.91 v46.99,46.86 | R13.2 7.84,19.5 5.87,21.47
N$14
  Bottom 0.254: 5.33,21.25 5.33,22.86
  Bottom 0.356: 5.33,22.86 5.33,54.19 7.66,56.52 44.32,56.52
  Bottom 0.406: R14.2 5.62,20.96 5.33,21.25 | 44.32,56.52 48.05,52.78 48.05,43.16 Q6.G
N$26
  Top 0.305: U$2.13 U$2.12
SCL
  Bottom 0.203: IC7.5 68.22,26.43 67.69,25.91 66.04,25.91 64.77,25.91 63.88,25.02 63.88,19.53 MCU1.19/A5
SCL2  (via drill 0.35)
  Top 0.203: I2C.2 76.71,54.86 76.71,48.3 73.16,44.75 66.56,44.75 64.01,42.2 64.01,28.07 66.8,25.27 66.8,21.97 v67.31,21.46
  Bottom 0.203: v67.31,21.46 67.37,21.4 67.37,20.64 68.14,19.88 69.09,18.92 69.09,17.78 69.09,17.27 71.68,14.68 73.69,14.68 MCU1.29
SDA
  Bottom 0.203: IC7.4 70.73,26.93 71.12,26.54 71.12,26.03 70.66,25.58 66.04,25.58 64.91,25.58 64.21,24.88 64.21,19.08 MCU1.18/A4
SDA2  (via drill 0.35)
  Top 0.203: I2C.1 71.88,55.12 76.2,50.8 76.2,48.26 73.03,45.09 66.42,45.09 63.68,42.34 63.68,27.8 66.42,25.06 66.42,21.46 v66.45,21.43
  Bottom 0.203: MCU1.30 68.74,17.09 68.74,17.78 68.74,18.77 66.42,21.08 66.42,21.4 v66.45,21.43
SENSE_A
  Top 0.305: U$2.3 46.75,10.81 39.16,3.21 C15.2
  Top 0.406: R16.1 R17.2 C15.2
SENSE_B
  Top 0.305: U$2.5 46.21,9.51 38.99,2.29 28.74,2.29 C16.2
  Top 0.406: R18.1 R19.2 C16.2
SENSE_C
  Top 0.305: C17.2 19.09,1.78 39.12,1.78 44.83,7.49 48.13,7.49 50.55,7.49 52.56,9.51 U$2.10
  Top 0.406: C17.2 R21.2 R20.1
THROTTLE
  Bottom 0.203: C9.1 73.15,26.84 73.15,20.3 MCU1.14/A0
  Bottom 0.305: C9.1 R7.2 R8.2
V_BAT
  Bottom 0.305: J3.2A 55.57,26.92 R23.1 58.2,26.03 61.59,26.03 62.99,27.43 IC7.8
  pour Top (isolate 0.61, no thermals): 43.18,27.94 55.88,27.94 55.88,22.86 43.18,22.86
V_PREFUSE
  pour Top (isolate 0.254, no thermals): 48.4,56.22 48.4,37.22 57,37.22 57,56.22
V_RAW
  Top 0.406: IC1.IN 69.44,49.67 62.61,42.83 62.61,32.13 61.62,31.14 D1.C
  Top 0.813: Q1.D 13.67,31.64 C10.+ 25.11,29.96 C4.+ | C4.+ 27.67,32.35 Q3.D | 55.85,31.07 47.06,31.07 R22.2 46.96,30.96 40.16,30.96 | C4.+ 25.24,29.93 C5.+ 39.13,29.93 40.16,30.96 | 40.16,30.96 41.67,32.47 Q5.D
  Top 1.27: D1.C 56.02,31.14 arc45 55.85,31.07
  Bottom 0.305: R24.1 57.32,29.63 58.83,31.14 D1.C
  pour Top (isolate 0.61, rank 4, no thermals): 7.62,43.69 48.26,43.69 48.26,35.56 50.29,33.53 63.5,33.53 63.5,27.94 7.62,27.94
VCC
  Bottom 0.305: IC7.6 63.95,26.43 63.08,25.56 C18.1
VDD
  Top 0.406: IC2.3 10.96,13.64 C12.1 15.49,15.34 15.49,16.51 | 43.43,19.05 43.43,15.24 41.4,13.21 C11.1 41.19,13.29 IC4.3 | 43.43,19.05 45.34,20.95 58.8,20.95 60.58,22.73 C20.1 61.3,23.58 IC5.IN 63.17,25.78 63.17,42.55 67.03,46.41 71.73,46.41 74.52,49.2 IC1.OUT | 43.43,19.05 42.42,18.03 30.48,18.03 29.59,18.03 29.59,15.44 27.84,13.69 | 27.84,13.69 C13.1 27.45,13.29 IC3.3 | 15.49,16.51 | 15.49,16.51 16.38,17.4 17.91,17.4 20.7,14.6 26.92,14.6 27.84,13.69
VS_A
  Top 0.305: U$2.2 U$2.1 48,12.62 48.64,13.26 48.64,18.8 49.28,19.43 56.24,19.43 MCU1.21/A7
VS_B
  Top 0.305: U$2.7 U$2.6 50.01,8.86 50.55,9.4 50.55,11.28 MCU1.A10
VS_C
  Top 0.305: U$2.8 U$2.9 54.71,8.86 55.24,9.4 55.24,13.43 MCU1.A11

### Text on the board
tPlace: Motor Controller v2.1 / Sensorless + Hall | A | B | C | VIN | GND | THROT | FUSE | SEM | HALL | TEENSY 3.2
bPlace: SDA | SCL | CANH | CANH | CANL | CANL | +5V | BLDC Controller 2.1 / Designed by GDC, May 2019 / DEV, Shell Eco-Marathon | THROT | GND